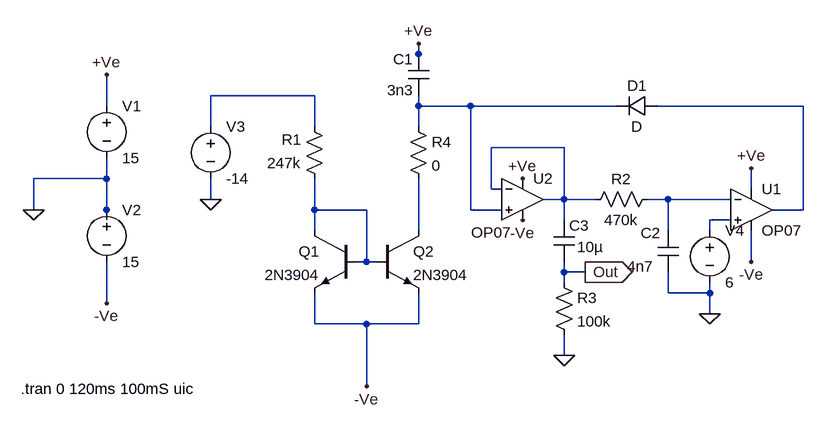
[diagram p0: schematic VCO.asc]
VCO.asc, the LTspice schematic file:
Version 4
SHEET 1 1208 680
WIRE 352 -144 352 -160
WIRE 352 -128 352 -144
WIRE 192 -80 32 -80
WIRE -128 -64 -128 -112
WIRE 352 -64 352 -80
WIRE 432 -64 352 -64
WIRE 656 -64 432 -64
WIRE 944 -64 720 -64
WIRE 32 -32 32 -80
WIRE 192 -32 192 -80
WIRE 352 -32 352 -64
WIRE 576 0 464 0
WIRE -128 48 -128 16
WIRE -128 48 -240 48
WIRE 464 64 464 0
WIRE 480 64 464 64
WIRE 864 64 864 32
WIRE 32 80 32 48
WIRE 576 80 576 0
WIRE 576 80 544 80
WIRE 624 80 576 80
WIRE 736 80 704 80
WIRE 832 80 736 80
WIRE -240 96 -240 48
WIRE -128 96 -128 48
WIRE 192 96 192 48
WIRE 272 96 192 96
WIRE 432 96 432 -64
WIRE 480 96 432 96
WIRE 944 96 944 -64
WIRE 944 96 896 96
WIRE -128 112 -128 96
WIRE 576 112 576 80
WIRE 832 112 800 112
WIRE 192 128 192 96
WIRE 352 128 352 48
WIRE 736 128 736 80
WIRE 800 128 800 112
WIRE 272 176 272 96
WIRE 272 176 256 176
WIRE 288 176 272 176
WIRE 864 176 864 128
WIRE 576 192 576 176
WIRE 608 192 576 192
WIRE 576 208 576 192
WIRE 736 224 736 192
WIRE 800 224 800 208
WIRE 800 224 736 224
WIRE -128 240 -128 176
WIRE 800 256 800 224
WIRE 192 272 192 224
WIRE 272 272 192 272
WIRE 352 272 352 224
WIRE 352 272 272 272
WIRE 576 320 576 288
WIRE 272 368 272 272
FLAG -240 96 0
FLAG -128 -112 +Ve
FLAG 800 256 0
FLAG 864 32 +Ve
FLAG -128 240 -Ve
FLAG 864 176 -Ve
FLAG 352 -160 +Ve
FLAG 512 48 +Ve
FLAG 512 112 -Ve
FLAG 272 368 -Ve
FLAG 32 80 0
FLAG 576 320 0
FLAG 608 192 Out
IOPIN 608 192 Out
SYMBOL npn 256 128 M0
SYMATTR InstName Q1
SYMATTR Value 2N3904
SYMBOL npn 288 128 R0
SYMATTR InstName Q2
SYMATTR Value 2N3904
SYMBOL res 208 64 R180
WINDOW 0 36 76 Left 2
WINDOW 3 36 40 Left 2
SYMATTR InstName R1
SYMATTR Value 247k
SYMBOL voltage -128 -80 R0
WINDOW 123 0 0 Left 2
WINDOW 39 0 0 Left 2
SYMATTR InstName V1
SYMATTR Value 15
SYMBOL voltage 32 -48 R0
WINDOW 123 0 0 Left 2
WINDOW 39 0 0 Left 2
SYMATTR InstName V3
SYMATTR Value -14
SYMBOL Opamps\\OP07 864 32 R0
SYMATTR InstName U1
SYMBOL cap 368 -144 M0
SYMATTR InstName C1
SYMATTR Value 3n3
SYMBOL voltage -128 80 R0
WINDOW 123 0 0 Left 2
WINDOW 39 0 0 Left 2
SYMATTR InstName V2
SYMATTR Value 15
SYMBOL res 720 64 R90
WINDOW 0 0 56 VBottom 2
WINDOW 3 32 56 VTop 2
SYMATTR InstName R2
SYMATTR Value 470k
SYMBOL Opamps\\OP07 512 16 R0
WINDOW 3 -79 115 Left 2
SYMATTR InstName U2
SYMBOL cap 720 128 R0
WINDOW 0 -26 4 Left 2
WINDOW 3 -47 55 Left 2
SYMATTR InstName C2
SYMATTR Value 4n7
SYMBOL res 336 -48 R0
SYMATTR InstName R4
SYMATTR Value 0
SYMBOL diode 720 -80 R90
WINDOW 0 0 32 VBottom 2
WINDOW 3 32 32 VTop 2
SYMATTR InstName D1
SYMBOL cap 560 112 R0
WINDOW 3 36 41 Left 2
SYMATTR InstName C3
SYMATTR Value 10µ
SYMBOL res 560 192 R0
SYMATTR InstName R3
SYMATTR Value 100k
SYMBOL voltage 800 112 R0
WINDOW 123 0 0 Left 2
WINDOW 39 0 0 Left 2
SYMATTR InstName V4
SYMATTR Value 6
TEXT -260 372 Left 2 !.tran 0 120ms 100mS uic

The netlist it stands for:
* VCO.asc
Q1 N006 N006 -Ve 0 2N3904
Q2 N008 N006 -Ve 0 2N3904
R1 N006 N001 247k
V1 +Ve 0 15
V3 N001 0 -14
XU1 N007 N005 +Ve -Ve N003 LT1001  ; OP07, pins In+ In- V+ V- OUT
C1 +Ve N002 3n3
V2 0 -Ve 15
R2 N005 N004 470k
XU2 N002 N004 +Ve -Ve N004 LT1001  ; OP07, pins In+ In- V+ V- OUT
C2 N005 0 4n7
R4 N002 N008 0
D1 N003 N002 D
C3 N004 Out 10µ
R3 Out 0 100k
V4 N007 0 6
.model D D
.lib standard.dio
.model NPN NPN
.model PNP PNP
.lib standard.bjt
.tran 0 120ms 100mS uic
.lib LTC.lib
.backanno
.end